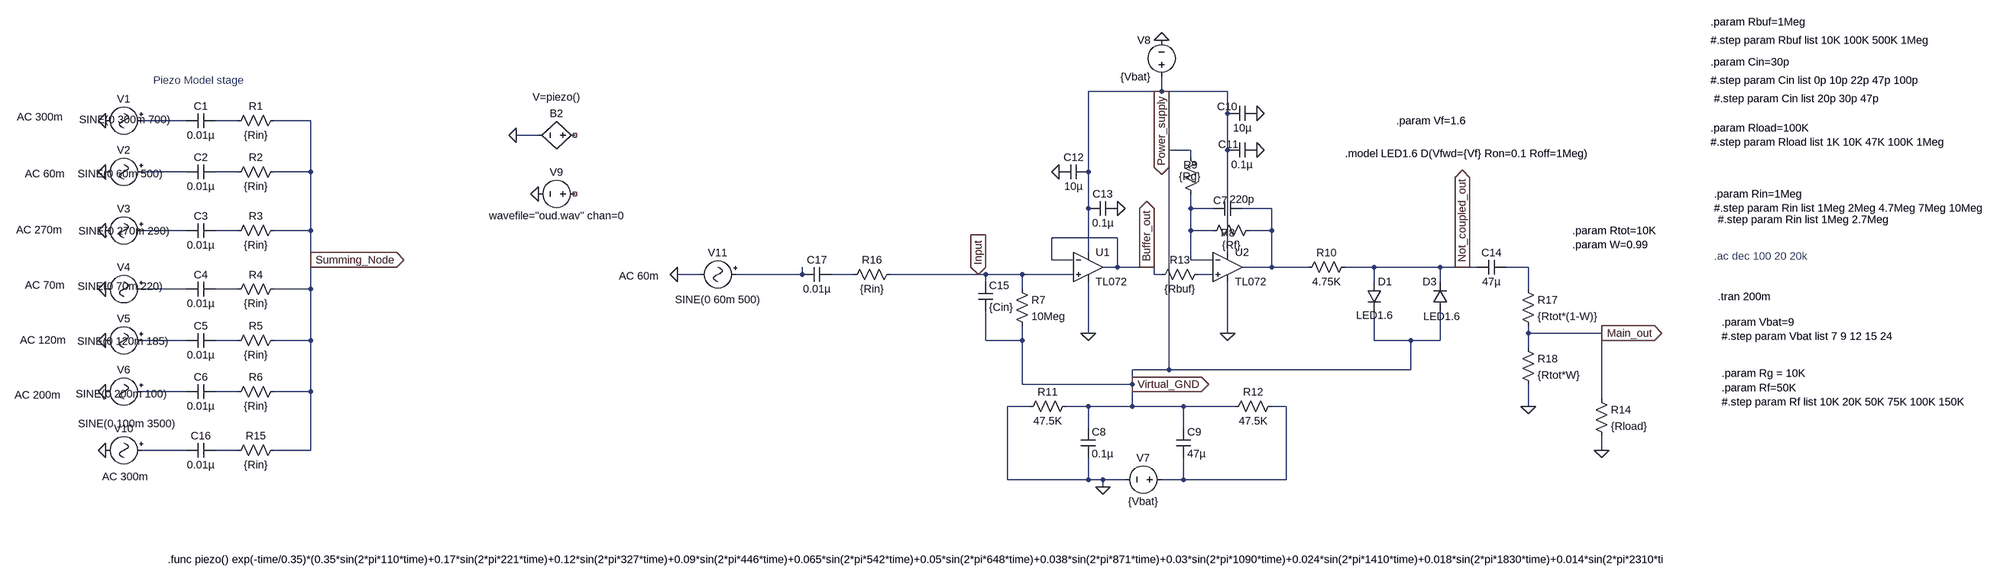
[diagram p0: schematic piezo_preamp_system.asc]
piezo_preamp_system.asc, the LTspice schematic file:
Version 4.1
SHEET 1 7720 1104
WIRE 1024 -80 1024 -112
WIRE 1024 -80 864 -80
WIRE 1168 -80 1024 -80
WIRE 1168 -32 1168 -80
WIRE -1104 -16 -1200 -16
WIRE -992 -16 -1040 -16
WIRE -832 -16 -912 -16
WIRE -336 16 -384 16
WIRE 1088 48 1040 48
WIRE 1168 48 1168 -32
WIRE 1088 64 1088 48
WIRE -1104 96 -1200 96
WIRE -992 96 -1040 96
WIRE -832 96 -832 -16
WIRE -832 96 -912 96
WIRE 864 96 864 -80
WIRE 864 176 864 96
WIRE 1088 176 1088 144
WIRE 1136 176 1088 176
WIRE 1264 176 1200 176
WIRE -1104 224 -1200 224
WIRE -992 224 -1040 224
WIRE -832 224 -832 96
WIRE -832 224 -912 224
WIRE 1088 224 1088 176
WIRE 1136 224 1088 224
WIRE 1264 224 1264 176
WIRE 1264 224 1216 224
WIRE 928 240 784 240
WIRE 864 272 864 176
WIRE 1168 272 1168 48
WIRE -832 288 -832 224
WIRE 784 288 784 240
WIRE 832 288 784 288
WIRE 1088 288 1088 224
WIRE 1136 288 1088 288
WIRE 928 304 928 240
WIRE 928 304 896 304
WIRE 992 304 928 304
WIRE 1008 304 992 304
WIRE 1264 304 1264 224
WIRE 1264 304 1200 304
WIRE 1344 304 1264 304
WIRE 1488 304 1424 304
WIRE 1632 304 1488 304
WIRE 1680 304 1632 304
WIRE 1712 304 1680 304
WIRE 1824 304 1776 304
WIRE 16 320 -32 320
WIRE 240 320 240 304
WIRE 240 320 96 320
WIRE 352 320 304 320
WIRE 624 320 432 320
WIRE 640 320 624 320
WIRE 720 320 640 320
WIRE 832 320 720 320
WIRE 1008 320 1008 304
WIRE 1024 320 1008 320
WIRE 1136 320 1104 320
WIRE 640 336 640 320
WIRE 1488 336 1488 304
WIRE 1632 336 1632 304
WIRE -1104 352 -1200 352
WIRE -992 352 -1040 352
WIRE -832 352 -832 288
WIRE -832 352 -912 352
WIRE 720 352 720 320
WIRE 1824 352 1824 304
WIRE 864 448 864 336
WIRE 1168 448 1168 336
WIRE 1824 448 1824 432
WIRE 1984 448 1824 448
WIRE -1104 464 -1200 464
WIRE -992 464 -1040 464
WIRE -832 464 -832 352
WIRE -832 464 -912 464
WIRE 640 464 640 400
WIRE 720 464 720 432
WIRE 720 464 640 464
WIRE 1488 464 1488 400
WIRE 1568 464 1488 464
WIRE 1632 464 1632 400
WIRE 1632 464 1568 464
WIRE 1824 480 1824 448
WIRE 1040 528 1040 48
WIRE 1040 528 960 528
WIRE 1568 528 1568 464
WIRE 1568 528 1040 528
WIRE 720 560 720 464
WIRE 960 560 960 528
WIRE 960 560 720 560
WIRE -1104 576 -1200 576
WIRE -992 576 -1040 576
WIRE -832 576 -832 464
WIRE -832 576 -912 576
WIRE 1984 592 1984 448
WIRE 736 608 688 608
WIRE 864 608 816 608
WIRE 960 608 960 560
WIRE 960 608 864 608
WIRE 1072 608 960 608
WIRE 1184 608 1072 608
WIRE 1296 608 1264 608
WIRE 1824 608 1824 560
WIRE 864 656 864 608
WIRE 1072 656 1072 608
WIRE -1104 704 -1200 704
WIRE -992 704 -1040 704
WIRE -832 704 -832 576
WIRE -832 704 -912 704
WIRE 1984 704 1984 672
WIRE 688 768 688 608
WIRE 864 768 864 720
WIRE 864 768 688 768
WIRE 896 768 864 768
WIRE 944 768 896 768
WIRE 1072 768 1072 720
WIRE 1072 768 1024 768
WIRE 1296 768 1296 608
WIRE 1296 768 1072 768
WIRE 896 784 896 768
FLAG -1280 -16 0
FLAG -1280 96 0
FLAG -1280 224 0
FLAG -1280 352 0
FLAG -1280 464 0
FLAG -1280 576 0
FLAG 864 448 0
FLAG 1168 448 0
FLAG 960 560 Virtual_GND
IOPIN 960 560 Out
FLAG 896 784 0
FLAG 928 176 0
FLAG 800 96 0
FLAG 1232 -32 0
FLAG 1232 48 0
FLAG 624 320 Input
IOPIN 624 320 In
FLAG 1984 704 0
FLAG 1984 448 Main_out
IOPIN 1984 448 Out
FLAG 992 304 Buffer_out
IOPIN 992 304 Out
FLAG -832 288 Summing_Node
IOPIN -832 288 Out
FLAG -1280 704 0
FLAG 1680 304 Not_coupled_out
IOPIN 1680 304 Out
FLAG 1024 -192 0
FLAG 1024 -80 Power_supply
IOPIN 1024 -80 Out
FLAG -384 16 0
FLAG -336 144 0
FLAG 1824 608 0
FLAG -32 320 0
SYMBOL cap -1040 -32 R90
WINDOW 0 0 32 VBottom 2
WINDOW 3 32 32 VTop 2
SYMATTR InstName C1
SYMATTR Value 0.01µ
SYMATTR SpiceLine V=25 Irms=0 Rser=0 Lser=0 mfg="Murata" pn="GRM033R71E103KE14" type="X7R"
SYMBOL Misc\\signal -1184 -16 R90
WINDOW 0 -32 56 VBottom 2
WINDOW 3 -18 53 VTop 2
WINDOW 123 7 239 VBottom 2
WINDOW 39 0 0 Left 0
SYMATTR InstName V1
SYMATTR Value SINE(0 300m 700)
SYMATTR Value2 AC 300m
SYMBOL Misc\\signal -1184 96 R90
WINDOW 0 -32 56 VBottom 2
WINDOW 3 -12 63 VTop 2
WINDOW 123 -12 228 VTop 2
WINDOW 39 0 0 Left 0
SYMATTR InstName V2
SYMATTR Value SINE(0 60m 500)
SYMATTR Value2 AC 60m
SYMBOL Misc\\signal -1184 224 R90
WINDOW 0 -32 56 VBottom 2
WINDOW 3 -15 55 VTop 2
WINDOW 123 -17 241 VTop 2
WINDOW 39 0 0 Left 0
SYMATTR InstName V3
SYMATTR Value SINE(0 270m 290)
SYMATTR Value2 AC 270m
SYMBOL Misc\\signal -1184 352 R90
WINDOW 0 -32 56 VBottom 2
WINDOW 3 -22 63 VTop 2
WINDOW 123 -24 228 VTop 2
WINDOW 39 0 0 Left 0
SYMATTR InstName V4
SYMATTR Value SINE(0 70m 220)
SYMATTR Value2 AC 70m
SYMBOL Misc\\signal -1184 464 R90
WINDOW 0 -32 56 VBottom 2
WINDOW 3 -14 57 VTop 2
WINDOW 123 -16 232 VTop 2
WINDOW 39 0 0 Left 0
SYMATTR InstName V5
SYMATTR Value SINE(0 120m 185)
SYMATTR Value2 AC 120m
SYMBOL Misc\\signal -1184 576 R90
WINDOW 0 -32 56 VBottom 2
WINDOW 3 -11 61 VTop 2
WINDOW 123 -8 244 VTop 2
WINDOW 39 0 0 Left 0
SYMATTR InstName V6
SYMATTR Value SINE(0 200m 100)
SYMATTR Value2 AC 200m
SYMBOL TL072 864 240 R0
SYMATTR InstName U1
SYMBOL res 704 336 R0
SYMATTR InstName R7
SYMATTR Value 10Meg
SYMBOL voltage 1024 -96 R180
WINDOW 0 24 96 Left 2
WINDOW 3 24 16 Left 2
WINDOW 123 0 0 Left 0
WINDOW 39 0 0 Left 0
SYMATTR InstName V8
SYMATTR Value {Vbat}
SYMBOL TL072 1168 240 R0
SYMATTR InstName U2
SYMBOL res 1232 208 R90
WINDOW 0 37 63 VBottom 2
WINDOW 3 32 56 VTop 2
SYMATTR InstName R8
SYMATTR Value {Rf}
SYMATTR SpiceLine tol=1 pwr=0.1
SYMBOL res 1072 48 R0
WINDOW 0 0 33 Left 2
WINDOW 3 -10 58 Left 2
SYMATTR InstName R9
SYMATTR Value {Rg}
SYMATTR SpiceLine tol=1 pwr=0.1
SYMBOL cap 1200 160 R90
WINDOW 0 14 48 VBottom 2
WINDOW 3 -20 0 VTop 2
SYMATTR InstName C7
SYMATTR Value 220p
SYMATTR SpiceLine V=25 Irms=0 Rser=0 Lser=0 mfg="Murata" pn="GRM0335C1E221JA01" type="C0G"
SYMBOL res 1440 288 R90
WINDOW 0 0 56 VBottom 2
WINDOW 3 32 56 VTop 2
SYMATTR InstName R10
SYMATTR Value 4.75K
SYMATTR SpiceLine tol=1 pwr=0.1
SYMBOL res 832 592 R90
WINDOW 0 0 56 VBottom 2
WINDOW 3 32 56 VTop 2
SYMATTR InstName R11
SYMATTR Value 47.5K
SYMATTR SpiceLine tol=1 pwr=0.1
SYMBOL res 1280 592 R90
WINDOW 0 0 56 VBottom 2
WINDOW 3 32 56 VTop 2
SYMATTR InstName R12
SYMATTR Value 47.5K
SYMATTR SpiceLine tol=1 pwr=0.1
SYMBOL voltage 1040 768 R90
WINDOW 0 -32 56 VBottom 2
WINDOW 3 32 56 VTop 2
WINDOW 123 0 0 Left 0
WINDOW 39 0 0 Left 0
SYMATTR InstName V7
SYMATTR Value {Vbat}
SYMBOL cap 848 656 R0
SYMATTR InstName C8
SYMATTR Value 0.1µ
SYMATTR SpiceLine V=25 Irms=0 Rser=0 Lser=0 mfg="Murata" pn="GCM155R71E104KE02" type="X7R"
SYMBOL cap 1056 656 R0
SYMATTR Value 47µ
SYMATTR InstName C9
SYMATTR SpiceLine V=25 Irms=1.15 Rser=0.125 Lser=0 mfg="Vishay" pn="TR3E476M025" type="Tantalum"
SYMBOL cap 1232 -48 R90
WINDOW 0 17 65 VBottom 2
WINDOW 3 32 32 VTop 2
SYMATTR InstName C10
SYMATTR Value 10µ
SYMATTR SpiceLine V=25 Irms=0 Rser=0 Lser=0 mfg="Murata" pn="GRM188R61E106KA73" type="X5R"
SYMBOL cap 1232 32 R90
WINDOW 0 19 62 VBottom 2
WINDOW 3 32 32 VTop 2
SYMATTR InstName C11
SYMATTR Value 0.1µ
SYMATTR SpiceLine V=25 Irms=728m Rser=0.14361 Lser=0 mfg="KEMET" pn="C0603C104K3RAC" type="X7R"
SYMBOL cap 864 80 R90
WINDOW 0 0 32 VBottom 2
WINDOW 3 32 32 VTop 2
SYMATTR InstName C12
SYMATTR Value 10µ
SYMATTR SpiceLine V=25 Irms=7.16 Rser=0.00732742 Lser=0 mfg="KEMET" pn="C1206C106K3PAC" type="X5R"
SYMBOL cap 928 160 R90
WINDOW 0 0 32 VBottom 2
WINDOW 3 32 32 VTop 2
SYMATTR InstName C13
SYMATTR Value 0.1µ
SYMATTR SpiceLine V=25 Irms=0 Rser=0.035 Lser=766p mfg="Würth Elektronik" pn="885012205085 WCAP-CSGP 0402" type="X7R"
SYMBOL cap -1040 80 R90
WINDOW 0 0 32 VBottom 2
WINDOW 3 32 32 VTop 2
SYMATTR InstName C2
SYMATTR Value 0.01µ
SYMATTR SpiceLine V=25 Irms=0 Rser=0 Lser=0 mfg="Murata" pn="GRM033R71E103KE14" type="X7R"
SYMBOL cap -1040 208 R90
WINDOW 0 0 32 VBottom 2
WINDOW 3 32 32 VTop 2
SYMATTR InstName C3
SYMATTR Value 0.01µ
SYMATTR SpiceLine V=25 Irms=0 Rser=0 Lser=0 mfg="Murata" pn="GRM033R71E103KE14" type="X7R"
SYMBOL cap -1040 336 R90
WINDOW 0 0 32 VBottom 2
WINDOW 3 32 32 VTop 2
SYMATTR InstName C4
SYMATTR Value 0.01µ
SYMATTR SpiceLine V=25 Irms=0 Rser=0 Lser=0 mfg="Murata" pn="GRM033R71E103KE14" type="X7R"
SYMBOL cap -1040 448 R90
WINDOW 0 0 32 VBottom 2
WINDOW 3 32 32 VTop 2
SYMATTR InstName C5
SYMATTR Value 0.01µ
SYMATTR SpiceLine V=25 Irms=0 Rser=0 Lser=0 mfg="Murata" pn="GRM033R71E103KE14" type="X7R"
SYMBOL cap -1040 560 R90
WINDOW 0 0 32 VBottom 2
WINDOW 3 32 32 VTop 2
SYMATTR InstName C6
SYMATTR Value 0.01µ
SYMATTR SpiceLine V=25 Irms=0 Rser=0 Lser=0 mfg="Murata" pn="GRM033R71E103KE14" type="X7R"
SYMBOL res 1120 304 R90
WINDOW 0 0 56 VBottom 2
WINDOW 3 32 56 VTop 2
SYMATTR InstName R13
SYMATTR Value {Rbuf}
SYMATTR SpiceLine tol=1 pwr=0.1
SYMBOL cap 1776 288 R90
WINDOW 0 0 32 VBottom 2
WINDOW 3 32 32 VTop 2
SYMATTR InstName C14
SYMATTR Value 47µ
SYMATTR SpiceLine V=35 Irms=1.4 Rser=0.15 Lser=0 mfg="Vishay" pn="T97N476M035" type="Tantalum Conf Coat"
SYMBOL res 1968 576 R0
SYMATTR InstName R14
SYMATTR Value {Rload}
SYMATTR SpiceLine tol=1 pwr=0.1
SYMBOL cap 624 336 R0
SYMATTR InstName C15
SYMATTR Value {Cin}
SYMATTR SpiceLine V=25 Irms=0 Rser=0 Lser=0
SYMBOL cap -1040 688 R90
WINDOW 0 0 32 VBottom 2
WINDOW 3 32 32 VTop 2
SYMATTR InstName C16
SYMATTR Value 0.01µ
SYMATTR SpiceLine V=25 Irms=0 Rser=0 Lser=0 mfg="Murata" pn="GRM033R71E103KE14" type="X7R"
SYMBOL Misc\\signal -1184 704 R90
WINDOW 0 -32 56 VBottom 2
WINDOW 3 -74 49 VTop 2
WINDOW 123 73 53 VBottom 2
WINDOW 39 0 0 Left 0
SYMATTR InstName V10
SYMATTR Value SINE(0 100m 3500)
SYMATTR Value2 AC 300m
SYMBOL res -896 688 R90
WINDOW 0 0 56 VBottom 2
WINDOW 3 32 56 VTop 2
SYMATTR InstName R15
SYMATTR Value {Rin}
SYMATTR SpiceLine tol=1 pwr=0.1
SYMBOL res -896 -32 R90
WINDOW 0 0 56 VBottom 2
WINDOW 3 32 56 VTop 2
SYMATTR InstName R1
SYMATTR Value {Rin}
SYMATTR SpiceLine tol=1 pwr=0.1
SYMBOL res -896 80 R90
WINDOW 0 0 56 VBottom 2
WINDOW 3 32 56 VTop 2
SYMATTR InstName R2
SYMATTR Value {Rin}
SYMATTR SpiceLine tol=1 pwr=0.1
SYMBOL res -896 208 R90
WINDOW 0 0 56 VBottom 2
WINDOW 3 32 56 VTop 2
SYMATTR InstName R3
SYMATTR Value {Rin}
SYMATTR SpiceLine tol=1 pwr=0.1
SYMBOL res -896 336 R90
WINDOW 0 0 56 VBottom 2
WINDOW 3 32 56 VTop 2
SYMATTR InstName R4
SYMATTR Value {Rin}
SYMATTR SpiceLine tol=1 pwr=0.1
SYMBOL res -896 448 R90
WINDOW 0 0 56 VBottom 2
WINDOW 3 32 56 VTop 2
SYMATTR InstName R5
SYMATTR Value {Rin}
SYMATTR SpiceLine tol=1 pwr=0.1
SYMBOL res -896 560 R90
WINDOW 0 0 56 VBottom 2
WINDOW 3 32 56 VTop 2
SYMATTR InstName R6
SYMATTR Value {Rin}
SYMATTR SpiceLine tol=1 pwr=0.1
SYMBOL cap 304 304 R90
WINDOW 0 0 32 VBottom 2
WINDOW 3 32 32 VTop 2
SYMATTR InstName C17
SYMATTR Value 0.01µ
SYMATTR SpiceLine V=25 Irms=0 Rser=0 Lser=0 mfg="Murata" pn="GRM033R71E103KE14" type="X7R"
SYMBOL res 448 304 R90
WINDOW 0 0 56 VBottom 2
WINDOW 3 32 56 VTop 2
SYMATTR InstName R16
SYMATTR Value {Rin}
SYMATTR SpiceLine tol=1 pwr=0.1
SYMBOL bv -240 16 R90
WINDOW 0 -32 56 VBottom 2
WINDOW 3 -68 56 VBottom 2
SYMATTR InstName B2
SYMATTR Value V=piezo()
SYMBOL voltage -240 144 R90
WINDOW 0 -32 56 VBottom 2
WINDOW 3 32 56 VTop 2
WINDOW 123 0 0 Left 0
WINDOW 39 0 0 Left 0
SYMATTR InstName V9
SYMATTR Value wavefile="oud.wav" chan=0
SYMBOL diode 1472 336 R0
WINDOW 3 123 76 Left 2
SYMATTR Value LED1.6
SYMATTR InstName D1
SYMBOL diode 1648 400 R180
WINDOW 0 24 64 Left 2
WINDOW 3 119 -9 Left 2
SYMATTR InstName D3
SYMATTR Value LED1.6
SYMBOL res 1808 336 R0
SYMATTR InstName R17
SYMATTR Value {Rtot*(1-W)}
SYMBOL res 1808 464 R0
SYMATTR InstName R18
SYMATTR Value {Rtot*W}
SYMBOL Misc\\signal 112 320 R90
WINDOW 0 -32 56 VBottom 2
WINDOW 3 39 56 VTop 2
WINDOW 123 -12 228 VTop 2
WINDOW 39 0 0 Left 0
SYMATTR InstName V11
SYMATTR Value SINE(0 60m 500)
SYMATTR Value2 AC 60m
TEXT 2248 280 Left 2 ;.ac dec 100 20 20k
TEXT -1176 -104 Left 2 ;Piezo Model stage
TEXT 2240 -144 Left 2 !.param Cin=30p
TEXT 2240 -104 Left 2 !#.step param Cin list 0p 10p 22p 47p 100p
TEXT 2240 0 Left 2 !.param Rload=100K\n#.step param Rload list 1K 10K 47K 100K 1Meg
TEXT 2248 144 Left 2 !.param Rin=1Meg\n#.step param Rin list 1Meg 2Meg 4.7Meg 7Meg 10Meg
TEXT 2264 424 Left 2 !.param Vbat=9\n#.step param Vbat list 7 9 12 15 24
TEXT 2264 536 Left 2 !.param Rg = 10K\n.param Rf=50K\n#.step param Rf list 10K 20K 50K 75K 100K 150K
TEXT 2256 368 Left 2 !.tran 200m
TEXT -1144 944 Left 2 !.func piezo() exp(-time/0.35)*(0.35*sin(2*pi*110*time)+0.17*sin(2*pi*221*time)+0.12*sin(2*pi*327*time)+0.09*sin(2*pi*446*time)+0.065*sin(2*pi*542*time)+0.05*sin(2*pi*648*time)+0.038*sin(2*pi*871*time)+0.03*sin(2*pi*1090*time)+0.024*sin(2*pi*1410*time)+0.018*sin(2*pi*1830*time)+0.014*sin(2*pi*2310*time)+0.011*sin(2*pi*3050*time)+0.008*sin(2*pi*4610*time)+0.005*sin(2*pi*6920*time)+0.003*sin(2*pi*9800*time))+0.15*exp(-time/0.002)+0.002*white(1)
TEXT 1424 56 Left 2 !.model LED1.6 D(Vfwd={Vf} Ron=0.1 Roff=1Meg)
TEXT 1920 224 Left 2 !.param Rtot=10K\n.param W=0.99
TEXT 1536 -16 Left 2 !.param Vf=1.6
TEXT 2248 -64 Left 2 !#.step param Cin list 20p 30p 47p
TEXT 2256 200 Left 2 !#.step param Rin list 1Meg 2.7Meg
TEXT 2240 -232 Left 2 !.param Rbuf=1Meg
TEXT 2240 -192 Left 2 !#.step param Rbuf list 10K 100K 500K 1Meg

The netlist it stands for:
* piezo_preamp_system.asc
C1 N002 N001 0.01µ V=25 Irms=0 Rser=0 Lser=0 mfg="Murata" pn="GRM033R71E103KE14" type="X7R"
V1 N001 0 SINE(0 300m 700) AC 300m
V2 N003 0 SINE(0 60m 500) AC 60m
V3 N007 0 SINE(0 270m 290) AC 270m
V4 N013 0 SINE(0 70m 220) AC 70m
V5 N015 0 SINE(0 120m 185) AC 120m
V6 N017 0 SINE(0 200m 100) AC 200m
* U1: TL072 (symbol TL072 not available, pins judged from their places): In+=Input In-=Buffer_out V+=Power_supply V-=0 OUT=Buffer_out
R7 Input Virtual_GND 10Meg
V8 Power_supply 0 {Vbat}
* U2: TL072 (symbol TL072 not available, pins judged from their places): In+=N012 In-=N005 V+=Power_supply V-=0 OUT=N006
R8 N006 N005 {Rf} tol=1 pwr=0.1
R9 Virtual_GND N005 {Rg} tol=1 pwr=0.1
C7 N006 N005 220p V=25 Irms=0 Rser=0 Lser=0 mfg="Murata" pn="GRM0335C1E221JA01" type="C0G"
R10 Not_coupled_out N006 4.75K tol=1 pwr=0.1
R11 Virtual_GND 0 47.5K tol=1 pwr=0.1
R12 N019 Virtual_GND 47.5K tol=1 pwr=0.1
V7 N019 0 {Vbat}
C8 Virtual_GND 0 0.1µ V=25 Irms=0 Rser=0 Lser=0 mfg="Murata" pn="GCM155R71E104KE02" type="X7R"
C9 Virtual_GND N019 47µ V=25 Irms=1.15 Rser=0.125 Lser=0 mfg="Vishay" pn="TR3E476M025" type="Tantalum"
C10 0 Power_supply 10µ V=25 Irms=0 Rser=0 Lser=0 mfg="Murata" pn="GRM188R61E106KA73" type="X5R"
C11 0 Power_supply 0.1µ V=25 Irms=728m Rser=0.14361 Lser=0 mfg="KEMET" pn="C0603C104K3RAC" type="X7R"
C12 Power_supply 0 10µ V=25 Irms=7.16 Rser=0.00732742 Lser=0 mfg="KEMET" pn="C1206C106K3PAC" type="X5R"
C13 0 Power_supply 0.1µ V=25 Irms=0 Rser=0.035 Lser=766p mfg="Würth Elektronik" pn="885012205085 WCAP-CSGP 0402" type="X7R"
C2 N004 N003 0.01µ V=25 Irms=0 Rser=0 Lser=0 mfg="Murata" pn="GRM033R71E103KE14" type="X7R"
C3 N008 N007 0.01µ V=25 Irms=0 Rser=0 Lser=0 mfg="Murata" pn="GRM033R71E103KE14" type="X7R"
C4 N014 N013 0.01µ V=25 Irms=0 Rser=0 Lser=0 mfg="Murata" pn="GRM033R71E103KE14" type="X7R"
C5 N016 N015 0.01µ V=25 Irms=0 Rser=0 Lser=0 mfg="Murata" pn="GRM033R71E103KE14" type="X7R"
C6 N018 N017 0.01µ V=25 Irms=0 Rser=0 Lser=0 mfg="Murata" pn="GRM033R71E103KE14" type="X7R"
R13 N012 Buffer_out {Rbuf} tol=1 pwr=0.1
C14 N009 Not_coupled_out 47µ V=35 Irms=1.4 Rser=0.15 Lser=0 mfg="Vishay" pn="T97N476M035" type="Tantalum Conf Coat"
R14 Main_out 0 {Rload} tol=1 pwr=0.1
C15 Input Virtual_GND {Cin} V=25 Irms=0 Rser=0 Lser=0
C16 N021 N020 0.01µ V=25 Irms=0 Rser=0 Lser=0 mfg="Murata" pn="GRM033R71E103KE14" type="X7R"
V10 N020 0 SINE(0 100m 3500) AC 300m
R15 Summing_Node N021 {Rin} tol=1 pwr=0.1
R1 Summing_Node N002 {Rin} tol=1 pwr=0.1
R2 Summing_Node N004 {Rin} tol=1 pwr=0.1
R3 Summing_Node N008 {Rin} tol=1 pwr=0.1
R4 Summing_Node N014 {Rin} tol=1 pwr=0.1
R5 Summing_Node N016 {Rin} tol=1 pwr=0.1
R6 Summing_Node N018 {Rin} tol=1 pwr=0.1
C17 N011 N010 0.01µ V=25 Irms=0 Rser=0 Lser=0 mfg="Murata" pn="GRM033R71E103KE14" type="X7R"
R16 Input N011 {Rin} tol=1 pwr=0.1
B2 NC_01 0 V=piezo()
V9 NC_02 0 wavefile="oud.wav" chan=0
D1 Not_coupled_out Virtual_GND LED1.6
D3 Virtual_GND Not_coupled_out LED1.6
R17 N009 Main_out {Rtot*(1-W)}
R18 Main_out 0 {Rtot*W}
V11 N010 0 SINE(0 60m 500) AC 60m
.model D D
.lib standard.dio
* .ac dec 100 20 20k
* Piezo Model stage
.param Cin=30p
#.step param Cin list 0p 10p 22p 47p 100p
.param Rload=100K
#.step param Rload list 1K 10K 47K 100K 1Meg
.param Rin=1Meg
#.step param Rin list 1Meg 2Meg 4.7Meg 7Meg 10Meg
.param Vbat=9
#.step param Vbat list 7 9 12 15 24
.param Rg = 10K
.param Rf=50K
#.step param Rf list 10K 20K 50K 75K 100K 150K
.tran 200m
.func piezo() exp(-time/0.35)*(0.35*sin(2*pi*110*time)+0.17*sin(2*pi*221*time)+0.12*sin(2*pi*327*time)+0.09*sin(2*pi*446*time)+0.065*sin(2*pi*542*time)+0.05*sin(2*pi*648*time)+0.038*sin(2*pi*871*time)+0.03*sin(2*pi*1090*time)+0.024*sin(2*pi*1410*time)+0.018*sin(2*pi*1830*time)+0.014*sin(2*pi*2310*time)+0.011*sin(2*pi*3050*time)+0.008*sin(2*pi*4610*time)+0.005*sin(2*pi*6920*time)+0.003*sin(2*pi*9800*time))+0.15*exp(-time/0.002)+0.002*white(1)
.model LED1.6 D(Vfwd={Vf} Ron=0.1 Roff=1Meg)
.param Rtot=10K
.param W=0.99
.param Vf=1.6
#.step param Cin list 20p 30p 47p
#.step param Rin list 1Meg 2.7Meg
.param Rbuf=1Meg
#.step param Rbuf list 10K 100K 500K 1Meg
.backanno
.end